# Altium schematic sheet Schematic.schdoc
size 800 x 327 mm
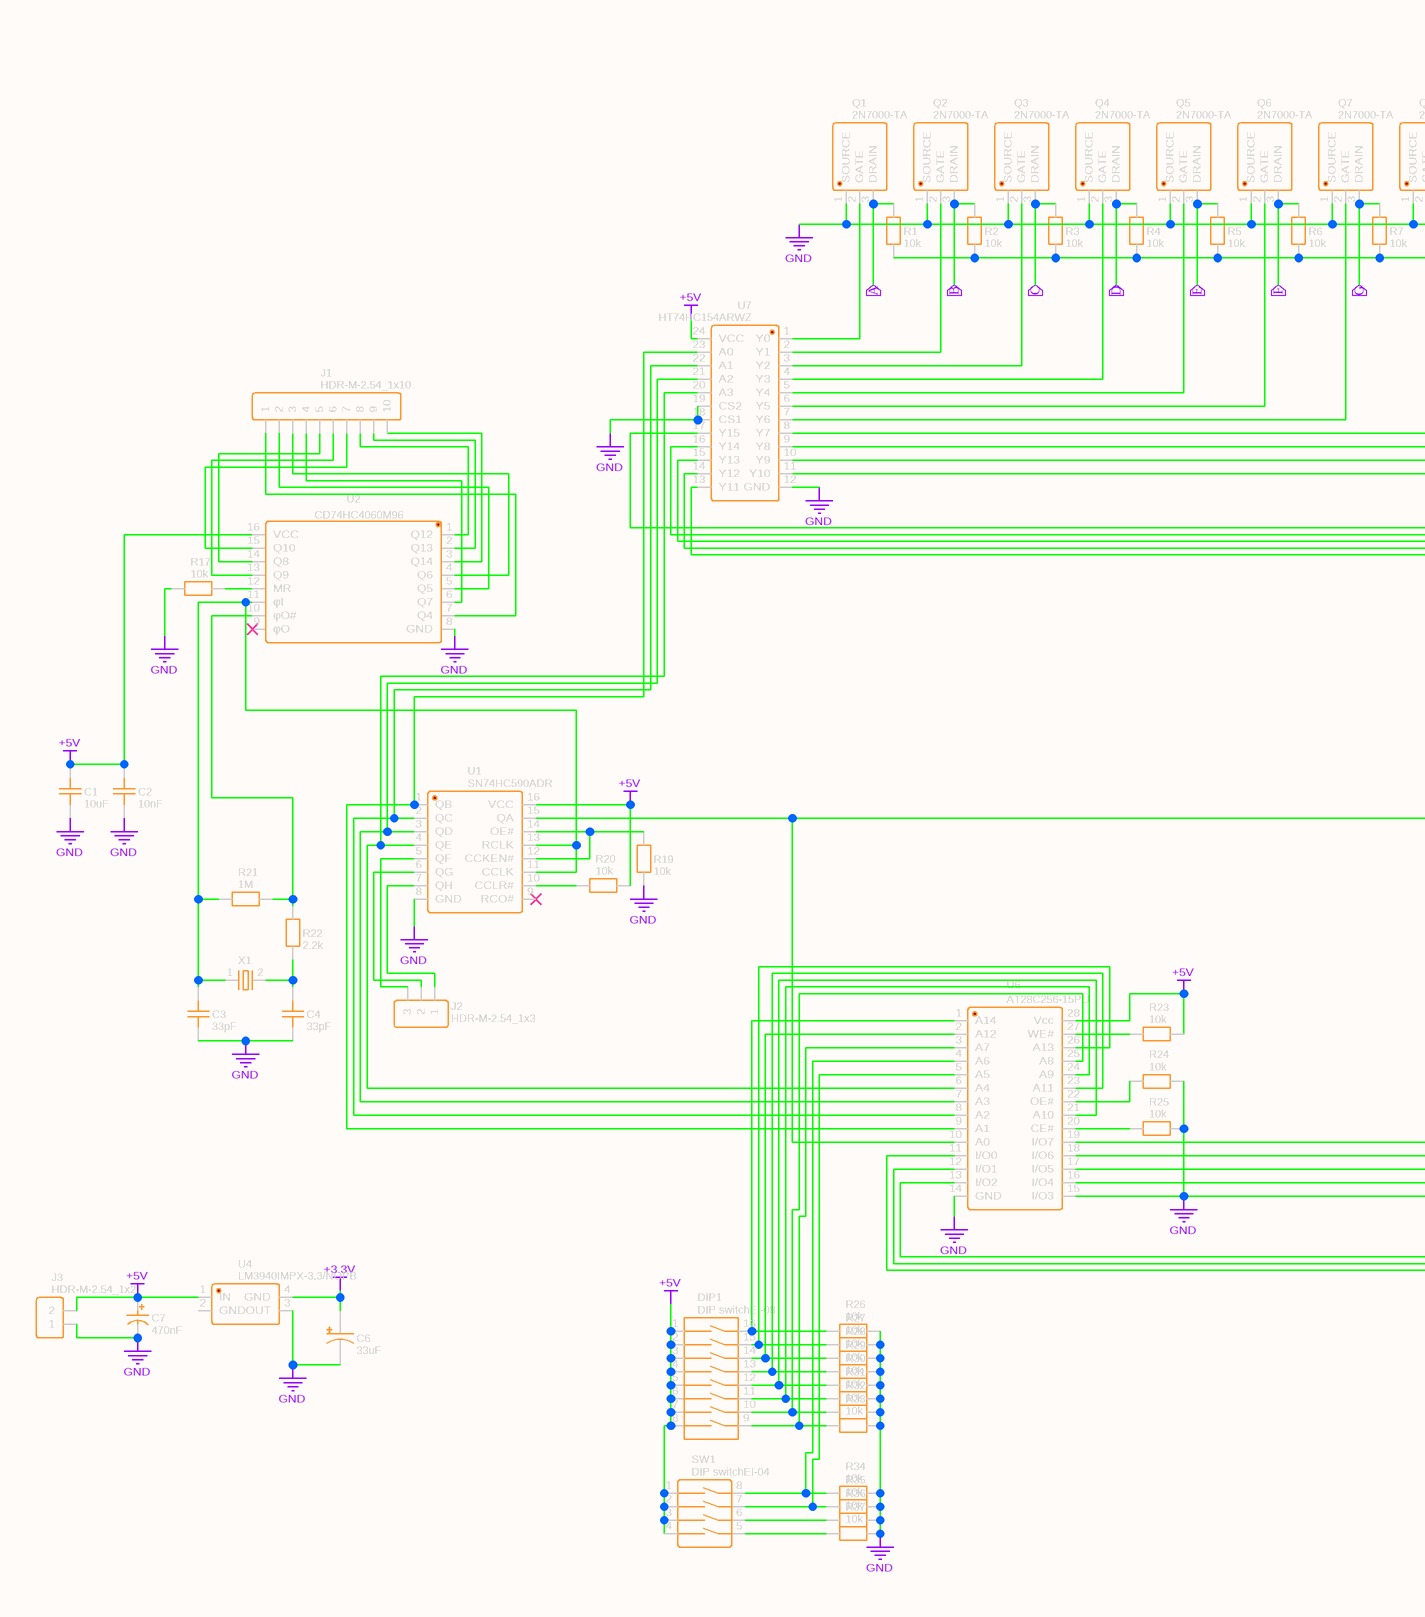
[diagram p0: Schematic.schdoc, left]
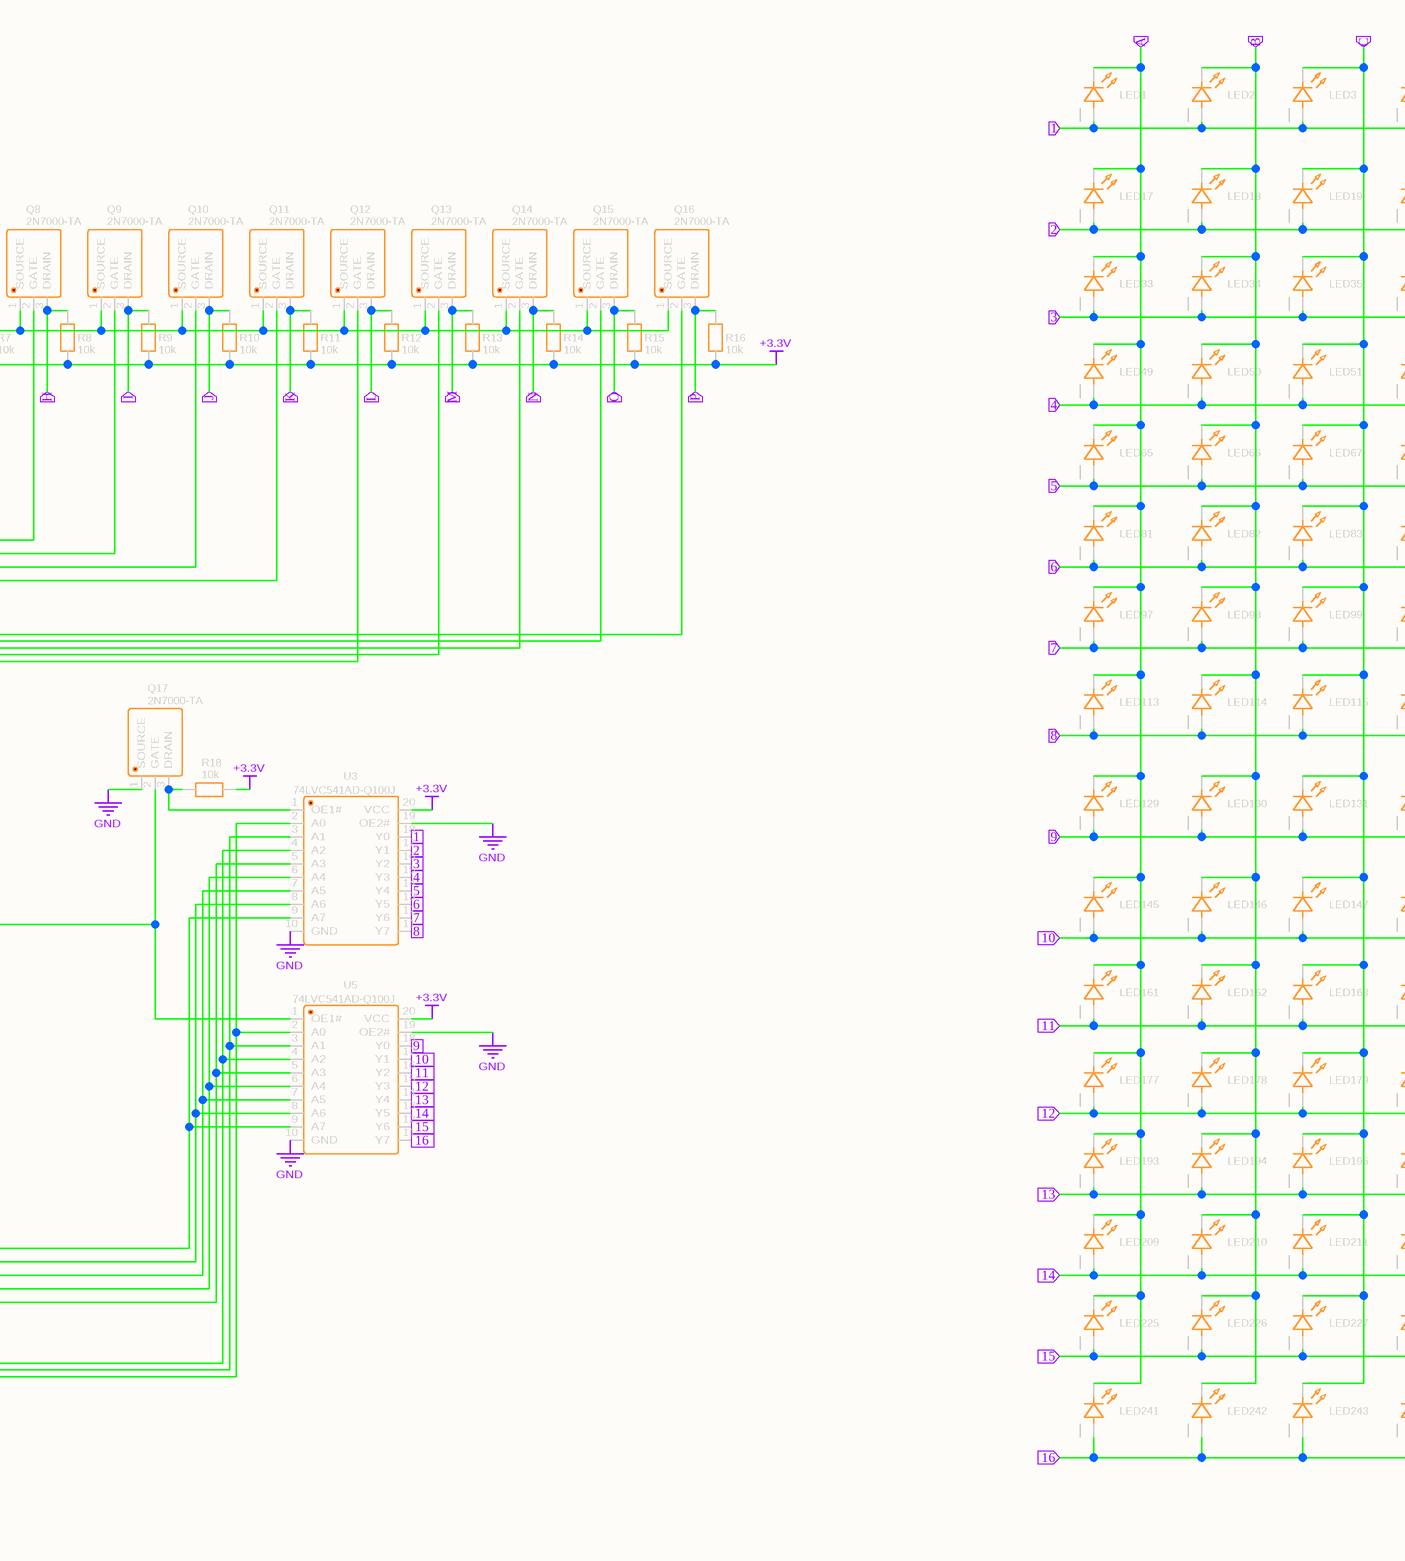
[diagram p1: Schematic.schdoc, middle]
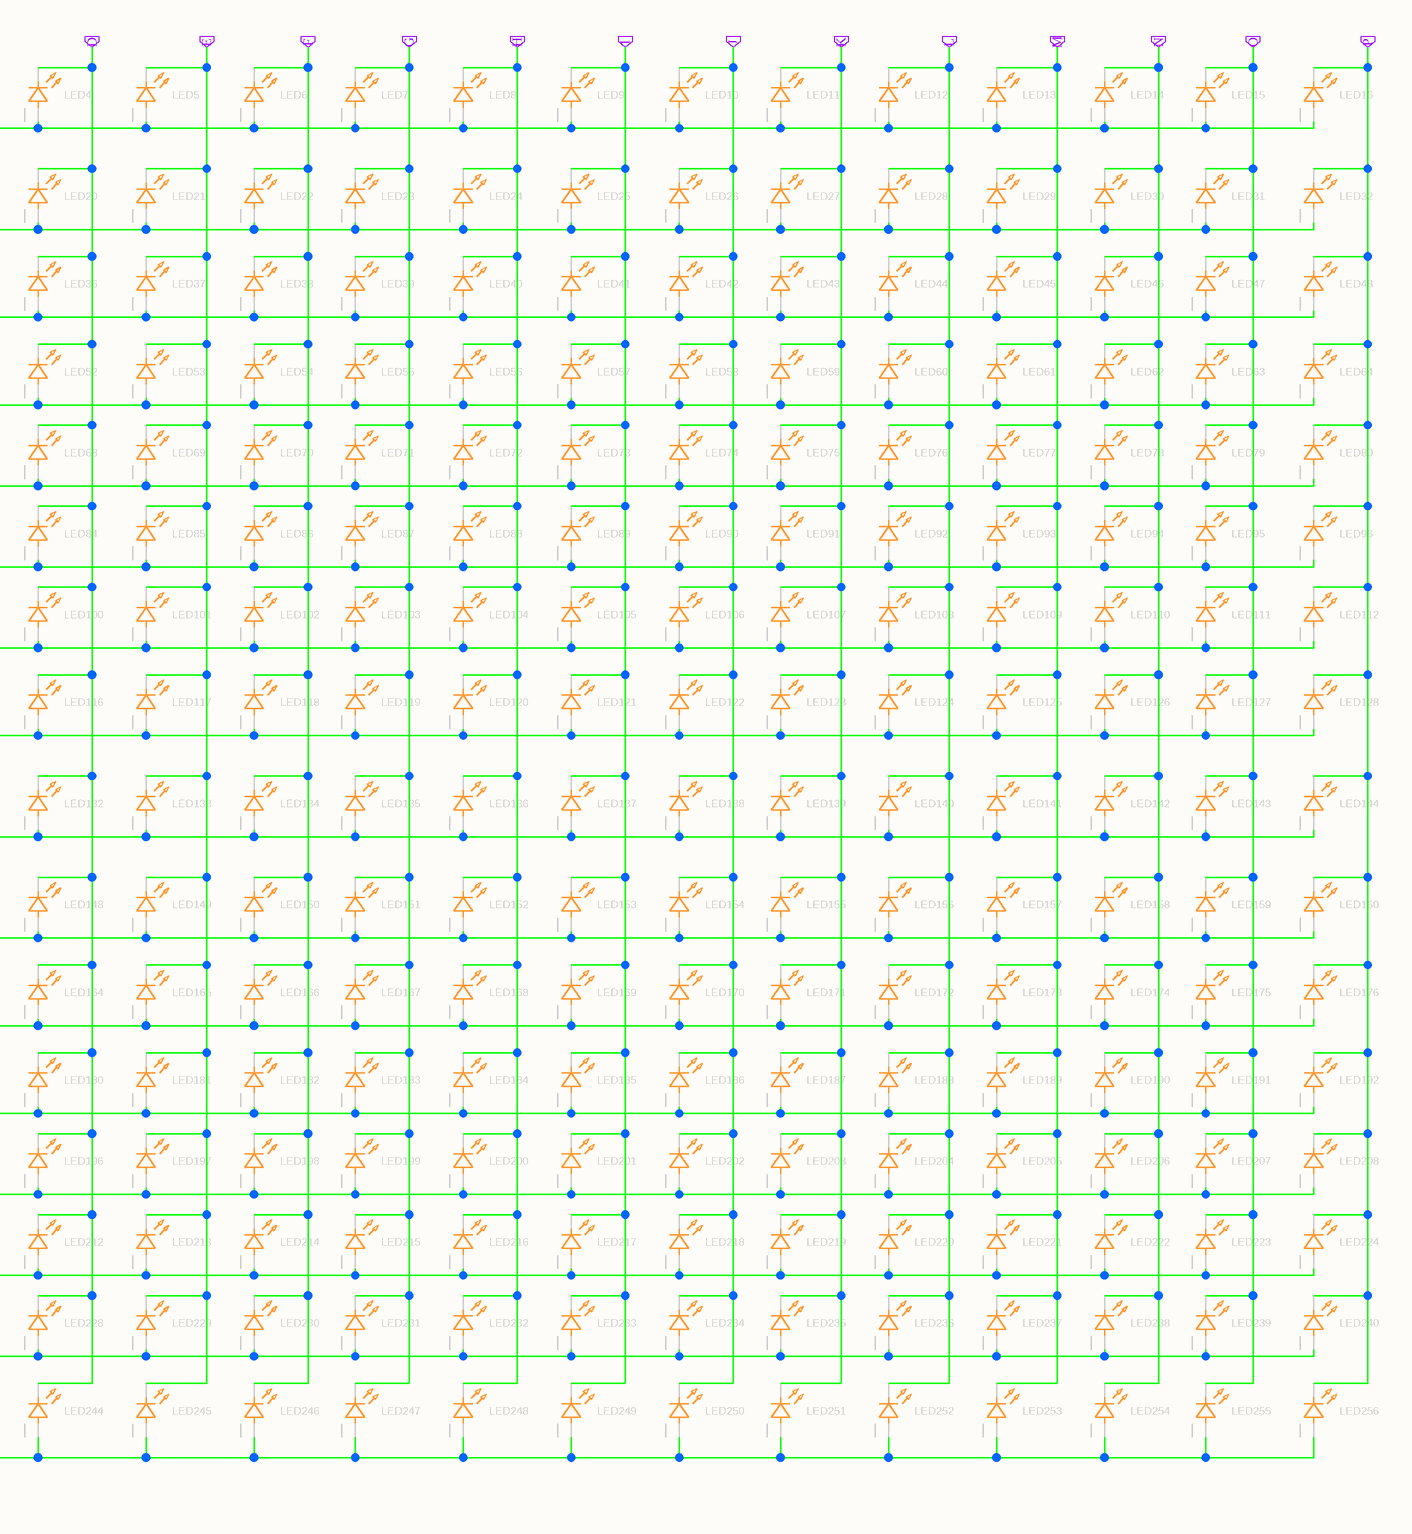
[diagram p2: Schematic.schdoc, right]

## Parts
C1  10uF  [C1210]
C2  10nF  [C0805]
C3  33pF  [C0805]
C4  33pF  [C0805]
C6  33uF  [CAP-TH_BD6.3-P2.50-D0.5-FD]
C7  470nF  [CAP-TH_BD4.0-P1.50-D0.8-FD]
DIP1  DIP switchEI-08  [SW-TH_16P-L20.5-W6.0-P2.54]
J1  HDR-M-2.54_1x10  [HDR-M-2.54_1X10]
J2  HDR-M-2.54_1x3  [HDR-M-2.54_1X3]
J3  HDR-M-2.54_1x2  [HDR-M-2.54_1X2]
LED1  HL-A-5730D34WY-S1-08-CZ(LY)  [LED-SMD_HL-A-5730D34WY-S1-08-CZ]  (value not drawn)
LED2  HL-A-5730D34WY-S1-08-CZ(LY)  [LED-SMD_HL-A-5730D34WY-S1-08-CZ]  (value not drawn)
LED3  HL-A-5730D34WY-S1-08-CZ(LY)  [LED-SMD_HL-A-5730D34WY-S1-08-CZ]  (value not drawn)
LED4  HL-A-5730D34WY-S1-08-CZ(LY)  [LED-SMD_HL-A-5730D34WY-S1-08-CZ]  (value not drawn)
LED5  HL-A-5730D34WY-S1-08-CZ(LY)  [LED-SMD_HL-A-5730D34WY-S1-08-CZ]  (value not drawn)
LED6  HL-A-5730D34WY-S1-08-CZ(LY)  [LED-SMD_HL-A-5730D34WY-S1-08-CZ]  (value not drawn)
LED7  HL-A-5730D34WY-S1-08-CZ(LY)  [LED-SMD_HL-A-5730D34WY-S1-08-CZ]  (value not drawn)
LED8  HL-A-5730D34WY-S1-08-CZ(LY)  [LED-SMD_HL-A-5730D34WY-S1-08-CZ]  (value not drawn)
LED9  HL-A-5730D34WY-S1-08-CZ(LY)  [LED-SMD_HL-A-5730D34WY-S1-08-CZ]  (value not drawn)
LED10  HL-A-5730D34WY-S1-08-CZ(LY)  [LED-SMD_HL-A-5730D34WY-S1-08-CZ]  (value not drawn)
LED11  HL-A-5730D34WY-S1-08-CZ(LY)  [LED-SMD_HL-A-5730D34WY-S1-08-CZ]  (value not drawn)
LED12  HL-A-5730D34WY-S1-08-CZ(LY)  [LED-SMD_HL-A-5730D34WY-S1-08-CZ]  (value not drawn)
LED13  HL-A-5730D34WY-S1-08-CZ(LY)  [LED-SMD_HL-A-5730D34WY-S1-08-CZ]  (value not drawn)
LED14  HL-A-5730D34WY-S1-08-CZ(LY)  [LED-SMD_HL-A-5730D34WY-S1-08-CZ]  (value not drawn)
LED15  HL-A-5730D34WY-S1-08-CZ(LY)  [LED-SMD_HL-A-5730D34WY-S1-08-CZ]  (value not drawn)
LED16  HL-A-5730D34WY-S1-08-CZ(LY)  [LED-SMD_HL-A-5730D34WY-S1-08-CZ]  (value not drawn)
LED17  HL-A-5730D34WY-S1-08-CZ(LY)  [LED-SMD_HL-A-5730D34WY-S1-08-CZ]  (value not drawn)
LED18  HL-A-5730D34WY-S1-08-CZ(LY)  [LED-SMD_HL-A-5730D34WY-S1-08-CZ]  (value not drawn)
LED19  HL-A-5730D34WY-S1-08-CZ(LY)  [LED-SMD_HL-A-5730D34WY-S1-08-CZ]  (value not drawn)
LED20  HL-A-5730D34WY-S1-08-CZ(LY)  [LED-SMD_HL-A-5730D34WY-S1-08-CZ]  (value not drawn)
LED21  HL-A-5730D34WY-S1-08-CZ(LY)  [LED-SMD_HL-A-5730D34WY-S1-08-CZ]  (value not drawn)
LED22  HL-A-5730D34WY-S1-08-CZ(LY)  [LED-SMD_HL-A-5730D34WY-S1-08-CZ]  (value not drawn)
LED23  HL-A-5730D34WY-S1-08-CZ(LY)  [LED-SMD_HL-A-5730D34WY-S1-08-CZ]  (value not drawn)
LED24  HL-A-5730D34WY-S1-08-CZ(LY)  [LED-SMD_HL-A-5730D34WY-S1-08-CZ]  (value not drawn)
LED25  HL-A-5730D34WY-S1-08-CZ(LY)  [LED-SMD_HL-A-5730D34WY-S1-08-CZ]  (value not drawn)
LED26  HL-A-5730D34WY-S1-08-CZ(LY)  [LED-SMD_HL-A-5730D34WY-S1-08-CZ]  (value not drawn)
LED27  HL-A-5730D34WY-S1-08-CZ(LY)  [LED-SMD_HL-A-5730D34WY-S1-08-CZ]  (value not drawn)
LED28  HL-A-5730D34WY-S1-08-CZ(LY)  [LED-SMD_HL-A-5730D34WY-S1-08-CZ]  (value not drawn)
LED29  HL-A-5730D34WY-S1-08-CZ(LY)  [LED-SMD_HL-A-5730D34WY-S1-08-CZ]  (value not drawn)
LED30  HL-A-5730D34WY-S1-08-CZ(LY)  [LED-SMD_HL-A-5730D34WY-S1-08-CZ]  (value not drawn)
LED31  HL-A-5730D34WY-S1-08-CZ(LY)  [LED-SMD_HL-A-5730D34WY-S1-08-CZ]  (value not drawn)
LED32  HL-A-5730D34WY-S1-08-CZ(LY)  [LED-SMD_HL-A-5730D34WY-S1-08-CZ]  (value not drawn)
LED33  HL-A-5730D34WY-S1-08-CZ(LY)  [LED-SMD_HL-A-5730D34WY-S1-08-CZ]  (value not drawn)
LED34  HL-A-5730D34WY-S1-08-CZ(LY)  [LED-SMD_HL-A-5730D34WY-S1-08-CZ]  (value not drawn)
LED35  HL-A-5730D34WY-S1-08-CZ(LY)  [LED-SMD_HL-A-5730D34WY-S1-08-CZ]  (value not drawn)
LED36  HL-A-5730D34WY-S1-08-CZ(LY)  [LED-SMD_HL-A-5730D34WY-S1-08-CZ]  (value not drawn)
LED37  HL-A-5730D34WY-S1-08-CZ(LY)  [LED-SMD_HL-A-5730D34WY-S1-08-CZ]  (value not drawn)
LED38  HL-A-5730D34WY-S1-08-CZ(LY)  [LED-SMD_HL-A-5730D34WY-S1-08-CZ]  (value not drawn)
LED39  HL-A-5730D34WY-S1-08-CZ(LY)  [LED-SMD_HL-A-5730D34WY-S1-08-CZ]  (value not drawn)
LED40  HL-A-5730D34WY-S1-08-CZ(LY)  [LED-SMD_HL-A-5730D34WY-S1-08-CZ]  (value not drawn)
LED41  HL-A-5730D34WY-S1-08-CZ(LY)  [LED-SMD_HL-A-5730D34WY-S1-08-CZ]  (value not drawn)
LED42  HL-A-5730D34WY-S1-08-CZ(LY)  [LED-SMD_HL-A-5730D34WY-S1-08-CZ]  (value not drawn)
LED43  HL-A-5730D34WY-S1-08-CZ(LY)  [LED-SMD_HL-A-5730D34WY-S1-08-CZ]  (value not drawn)
LED44  HL-A-5730D34WY-S1-08-CZ(LY)  [LED-SMD_HL-A-5730D34WY-S1-08-CZ]  (value not drawn)
LED45  HL-A-5730D34WY-S1-08-CZ(LY)  [LED-SMD_HL-A-5730D34WY-S1-08-CZ]  (value not drawn)
LED46  HL-A-5730D34WY-S1-08-CZ(LY)  [LED-SMD_HL-A-5730D34WY-S1-08-CZ]  (value not drawn)
LED47  HL-A-5730D34WY-S1-08-CZ(LY)  [LED-SMD_HL-A-5730D34WY-S1-08-CZ]  (value not drawn)
LED48  HL-A-5730D34WY-S1-08-CZ(LY)  [LED-SMD_HL-A-5730D34WY-S1-08-CZ]  (value not drawn)
LED49  HL-A-5730D34WY-S1-08-CZ(LY)  [LED-SMD_HL-A-5730D34WY-S1-08-CZ]  (value not drawn)
LED50  HL-A-5730D34WY-S1-08-CZ(LY)  [LED-SMD_HL-A-5730D34WY-S1-08-CZ]  (value not drawn)
LED51  HL-A-5730D34WY-S1-08-CZ(LY)  [LED-SMD_HL-A-5730D34WY-S1-08-CZ]  (value not drawn)
LED52  HL-A-5730D34WY-S1-08-CZ(LY)  [LED-SMD_HL-A-5730D34WY-S1-08-CZ]  (value not drawn)
LED53  HL-A-5730D34WY-S1-08-CZ(LY)  [LED-SMD_HL-A-5730D34WY-S1-08-CZ]  (value not drawn)
LED54  HL-A-5730D34WY-S1-08-CZ(LY)  [LED-SMD_HL-A-5730D34WY-S1-08-CZ]  (value not drawn)
LED55  HL-A-5730D34WY-S1-08-CZ(LY)  [LED-SMD_HL-A-5730D34WY-S1-08-CZ]  (value not drawn)
LED56  HL-A-5730D34WY-S1-08-CZ(LY)  [LED-SMD_HL-A-5730D34WY-S1-08-CZ]  (value not drawn)
LED57  HL-A-5730D34WY-S1-08-CZ(LY)  [LED-SMD_HL-A-5730D34WY-S1-08-CZ]  (value not drawn)
LED58  HL-A-5730D34WY-S1-08-CZ(LY)  [LED-SMD_HL-A-5730D34WY-S1-08-CZ]  (value not drawn)
LED59  HL-A-5730D34WY-S1-08-CZ(LY)  [LED-SMD_HL-A-5730D34WY-S1-08-CZ]  (value not drawn)
LED60  HL-A-5730D34WY-S1-08-CZ(LY)  [LED-SMD_HL-A-5730D34WY-S1-08-CZ]  (value not drawn)
LED61  HL-A-5730D34WY-S1-08-CZ(LY)  [LED-SMD_HL-A-5730D34WY-S1-08-CZ]  (value not drawn)
LED62  HL-A-5730D34WY-S1-08-CZ(LY)  [LED-SMD_HL-A-5730D34WY-S1-08-CZ]  (value not drawn)
LED63  HL-A-5730D34WY-S1-08-CZ(LY)  [LED-SMD_HL-A-5730D34WY-S1-08-CZ]  (value not drawn)
LED64  HL-A-5730D34WY-S1-08-CZ(LY)  [LED-SMD_HL-A-5730D34WY-S1-08-CZ]  (value not drawn)
LED65  HL-A-5730D34WY-S1-08-CZ(LY)  [LED-SMD_HL-A-5730D34WY-S1-08-CZ]  (value not drawn)
LED66  HL-A-5730D34WY-S1-08-CZ(LY)  [LED-SMD_HL-A-5730D34WY-S1-08-CZ]  (value not drawn)
LED67  HL-A-5730D34WY-S1-08-CZ(LY)  [LED-SMD_HL-A-5730D34WY-S1-08-CZ]  (value not drawn)
LED68  HL-A-5730D34WY-S1-08-CZ(LY)  [LED-SMD_HL-A-5730D34WY-S1-08-CZ]  (value not drawn)
LED69  HL-A-5730D34WY-S1-08-CZ(LY)  [LED-SMD_HL-A-5730D34WY-S1-08-CZ]  (value not drawn)
LED70  HL-A-5730D34WY-S1-08-CZ(LY)  [LED-SMD_HL-A-5730D34WY-S1-08-CZ]  (value not drawn)
LED71  HL-A-5730D34WY-S1-08-CZ(LY)  [LED-SMD_HL-A-5730D34WY-S1-08-CZ]  (value not drawn)
LED72  HL-A-5730D34WY-S1-08-CZ(LY)  [LED-SMD_HL-A-5730D34WY-S1-08-CZ]  (value not drawn)
LED73  HL-A-5730D34WY-S1-08-CZ(LY)  [LED-SMD_HL-A-5730D34WY-S1-08-CZ]  (value not drawn)
LED74  HL-A-5730D34WY-S1-08-CZ(LY)  [LED-SMD_HL-A-5730D34WY-S1-08-CZ]  (value not drawn)
LED75  HL-A-5730D34WY-S1-08-CZ(LY)  [LED-SMD_HL-A-5730D34WY-S1-08-CZ]  (value not drawn)
LED76  HL-A-5730D34WY-S1-08-CZ(LY)  [LED-SMD_HL-A-5730D34WY-S1-08-CZ]  (value not drawn)
LED77  HL-A-5730D34WY-S1-08-CZ(LY)  [LED-SMD_HL-A-5730D34WY-S1-08-CZ]  (value not drawn)
LED78  HL-A-5730D34WY-S1-08-CZ(LY)  [LED-SMD_HL-A-5730D34WY-S1-08-CZ]  (value not drawn)
LED79  HL-A-5730D34WY-S1-08-CZ(LY)  [LED-SMD_HL-A-5730D34WY-S1-08-CZ]  (value not drawn)
LED80  HL-A-5730D34WY-S1-08-CZ(LY)  [LED-SMD_HL-A-5730D34WY-S1-08-CZ]  (value not drawn)
LED81  HL-A-5730D34WY-S1-08-CZ(LY)  [LED-SMD_HL-A-5730D34WY-S1-08-CZ]  (value not drawn)
LED82  HL-A-5730D34WY-S1-08-CZ(LY)  [LED-SMD_HL-A-5730D34WY-S1-08-CZ]  (value not drawn)
LED83  HL-A-5730D34WY-S1-08-CZ(LY)  [LED-SMD_HL-A-5730D34WY-S1-08-CZ]  (value not drawn)
LED84  HL-A-5730D34WY-S1-08-CZ(LY)  [LED-SMD_HL-A-5730D34WY-S1-08-CZ]  (value not drawn)
LED85  HL-A-5730D34WY-S1-08-CZ(LY)  [LED-SMD_HL-A-5730D34WY-S1-08-CZ]  (value not drawn)
LED86  HL-A-5730D34WY-S1-08-CZ(LY)  [LED-SMD_HL-A-5730D34WY-S1-08-CZ]  (value not drawn)
LED87  HL-A-5730D34WY-S1-08-CZ(LY)  [LED-SMD_HL-A-5730D34WY-S1-08-CZ]  (value not drawn)
LED88  HL-A-5730D34WY-S1-08-CZ(LY)  [LED-SMD_HL-A-5730D34WY-S1-08-CZ]  (value not drawn)
LED89  HL-A-5730D34WY-S1-08-CZ(LY)  [LED-SMD_HL-A-5730D34WY-S1-08-CZ]  (value not drawn)
LED90  HL-A-5730D34WY-S1-08-CZ(LY)  [LED-SMD_HL-A-5730D34WY-S1-08-CZ]  (value not drawn)
LED91  HL-A-5730D34WY-S1-08-CZ(LY)  [LED-SMD_HL-A-5730D34WY-S1-08-CZ]  (value not drawn)
LED92  HL-A-5730D34WY-S1-08-CZ(LY)  [LED-SMD_HL-A-5730D34WY-S1-08-CZ]  (value not drawn)
LED93  HL-A-5730D34WY-S1-08-CZ(LY)  [LED-SMD_HL-A-5730D34WY-S1-08-CZ]  (value not drawn)
LED94  HL-A-5730D34WY-S1-08-CZ(LY)  [LED-SMD_HL-A-5730D34WY-S1-08-CZ]  (value not drawn)
LED95  HL-A-5730D34WY-S1-08-CZ(LY)  [LED-SMD_HL-A-5730D34WY-S1-08-CZ]  (value not drawn)
LED96  HL-A-5730D34WY-S1-08-CZ(LY)  [LED-SMD_HL-A-5730D34WY-S1-08-CZ]  (value not drawn)
LED97  HL-A-5730D34WY-S1-08-CZ(LY)  [LED-SMD_HL-A-5730D34WY-S1-08-CZ]  (value not drawn)
LED98  HL-A-5730D34WY-S1-08-CZ(LY)  [LED-SMD_HL-A-5730D34WY-S1-08-CZ]  (value not drawn)
LED99  HL-A-5730D34WY-S1-08-CZ(LY)  [LED-SMD_HL-A-5730D34WY-S1-08-CZ]  (value not drawn)
LED100  HL-A-5730D34WY-S1-08-CZ(LY)  [LED-SMD_HL-A-5730D34WY-S1-08-CZ]  (value not drawn)
LED101  HL-A-5730D34WY-S1-08-CZ(LY)  [LED-SMD_HL-A-5730D34WY-S1-08-CZ]  (value not drawn)
LED102  HL-A-5730D34WY-S1-08-CZ(LY)  [LED-SMD_HL-A-5730D34WY-S1-08-CZ]  (value not drawn)
LED103  HL-A-5730D34WY-S1-08-CZ(LY)  [LED-SMD_HL-A-5730D34WY-S1-08-CZ]  (value not drawn)
LED104  HL-A-5730D34WY-S1-08-CZ(LY)  [LED-SMD_HL-A-5730D34WY-S1-08-CZ]  (value not drawn)
LED105  HL-A-5730D34WY-S1-08-CZ(LY)  [LED-SMD_HL-A-5730D34WY-S1-08-CZ]  (value not drawn)
LED106  HL-A-5730D34WY-S1-08-CZ(LY)  [LED-SMD_HL-A-5730D34WY-S1-08-CZ]  (value not drawn)
LED107  HL-A-5730D34WY-S1-08-CZ(LY)  [LED-SMD_HL-A-5730D34WY-S1-08-CZ]  (value not drawn)
LED108  HL-A-5730D34WY-S1-08-CZ(LY)  [LED-SMD_HL-A-5730D34WY-S1-08-CZ]  (value not drawn)
LED109  HL-A-5730D34WY-S1-08-CZ(LY)  [LED-SMD_HL-A-5730D34WY-S1-08-CZ]  (value not drawn)
LED110  HL-A-5730D34WY-S1-08-CZ(LY)  [LED-SMD_HL-A-5730D34WY-S1-08-CZ]  (value not drawn)
LED111  HL-A-5730D34WY-S1-08-CZ(LY)  [LED-SMD_HL-A-5730D34WY-S1-08-CZ]  (value not drawn)
LED112  HL-A-5730D34WY-S1-08-CZ(LY)  [LED-SMD_HL-A-5730D34WY-S1-08-CZ]  (value not drawn)
LED113  HL-A-5730D34WY-S1-08-CZ(LY)  [LED-SMD_HL-A-5730D34WY-S1-08-CZ]  (value not drawn)
LED114  HL-A-5730D34WY-S1-08-CZ(LY)  [LED-SMD_HL-A-5730D34WY-S1-08-CZ]  (value not drawn)
LED115  HL-A-5730D34WY-S1-08-CZ(LY)  [LED-SMD_HL-A-5730D34WY-S1-08-CZ]  (value not drawn)
LED116  HL-A-5730D34WY-S1-08-CZ(LY)  [LED-SMD_HL-A-5730D34WY-S1-08-CZ]  (value not drawn)
LED117  HL-A-5730D34WY-S1-08-CZ(LY)  [LED-SMD_HL-A-5730D34WY-S1-08-CZ]  (value not drawn)
LED118  HL-A-5730D34WY-S1-08-CZ(LY)  [LED-SMD_HL-A-5730D34WY-S1-08-CZ]  (value not drawn)
LED119  HL-A-5730D34WY-S1-08-CZ(LY)  [LED-SMD_HL-A-5730D34WY-S1-08-CZ]  (value not drawn)
LED120  HL-A-5730D34WY-S1-08-CZ(LY)  [LED-SMD_HL-A-5730D34WY-S1-08-CZ]  (value not drawn)
LED121  HL-A-5730D34WY-S1-08-CZ(LY)  [LED-SMD_HL-A-5730D34WY-S1-08-CZ]  (value not drawn)
LED122  HL-A-5730D34WY-S1-08-CZ(LY)  [LED-SMD_HL-A-5730D34WY-S1-08-CZ]  (value not drawn)
LED123  HL-A-5730D34WY-S1-08-CZ(LY)  [LED-SMD_HL-A-5730D34WY-S1-08-CZ]  (value not drawn)
LED124  HL-A-5730D34WY-S1-08-CZ(LY)  [LED-SMD_HL-A-5730D34WY-S1-08-CZ]  (value not drawn)
LED125  HL-A-5730D34WY-S1-08-CZ(LY)  [LED-SMD_HL-A-5730D34WY-S1-08-CZ]  (value not drawn)
LED126  HL-A-5730D34WY-S1-08-CZ(LY)  [LED-SMD_HL-A-5730D34WY-S1-08-CZ]  (value not drawn)
LED127  HL-A-5730D34WY-S1-08-CZ(LY)  [LED-SMD_HL-A-5730D34WY-S1-08-CZ]  (value not drawn)
LED128  HL-A-5730D34WY-S1-08-CZ(LY)  [LED-SMD_HL-A-5730D34WY-S1-08-CZ]  (value not drawn)
LED129  HL-A-5730D34WY-S1-08-CZ(LY)  [LED-SMD_HL-A-5730D34WY-S1-08-CZ]  (value not drawn)
LED130  HL-A-5730D34WY-S1-08-CZ(LY)  [LED-SMD_HL-A-5730D34WY-S1-08-CZ]  (value not drawn)
LED131  HL-A-5730D34WY-S1-08-CZ(LY)  [LED-SMD_HL-A-5730D34WY-S1-08-CZ]  (value not drawn)
LED132  HL-A-5730D34WY-S1-08-CZ(LY)  [LED-SMD_HL-A-5730D34WY-S1-08-CZ]  (value not drawn)
LED133  HL-A-5730D34WY-S1-08-CZ(LY)  [LED-SMD_HL-A-5730D34WY-S1-08-CZ]  (value not drawn)
LED134  HL-A-5730D34WY-S1-08-CZ(LY)  [LED-SMD_HL-A-5730D34WY-S1-08-CZ]  (value not drawn)
LED135  HL-A-5730D34WY-S1-08-CZ(LY)  [LED-SMD_HL-A-5730D34WY-S1-08-CZ]  (value not drawn)
LED136  HL-A-5730D34WY-S1-08-CZ(LY)  [LED-SMD_HL-A-5730D34WY-S1-08-CZ]  (value not drawn)
LED137  HL-A-5730D34WY-S1-08-CZ(LY)  [LED-SMD_HL-A-5730D34WY-S1-08-CZ]  (value not drawn)
LED138  HL-A-5730D34WY-S1-08-CZ(LY)  [LED-SMD_HL-A-5730D34WY-S1-08-CZ]  (value not drawn)
LED139  HL-A-5730D34WY-S1-08-CZ(LY)  [LED-SMD_HL-A-5730D34WY-S1-08-CZ]  (value not drawn)
LED140  HL-A-5730D34WY-S1-08-CZ(LY)  [LED-SMD_HL-A-5730D34WY-S1-08-CZ]  (value not drawn)
LED141  HL-A-5730D34WY-S1-08-CZ(LY)  [LED-SMD_HL-A-5730D34WY-S1-08-CZ]  (value not drawn)
LED142  HL-A-5730D34WY-S1-08-CZ(LY)  [LED-SMD_HL-A-5730D34WY-S1-08-CZ]  (value not drawn)
LED143  HL-A-5730D34WY-S1-08-CZ(LY)  [LED-SMD_HL-A-5730D34WY-S1-08-CZ]  (value not drawn)
LED144  HL-A-5730D34WY-S1-08-CZ(LY)  [LED-SMD_HL-A-5730D34WY-S1-08-CZ]  (value not drawn)
LED145  HL-A-5730D34WY-S1-08-CZ(LY)  [LED-SMD_HL-A-5730D34WY-S1-08-CZ]  (value not drawn)
LED146  HL-A-5730D34WY-S1-08-CZ(LY)  [LED-SMD_HL-A-5730D34WY-S1-08-CZ]  (value not drawn)
LED147  HL-A-5730D34WY-S1-08-CZ(LY)  [LED-SMD_HL-A-5730D34WY-S1-08-CZ]  (value not drawn)
LED148  HL-A-5730D34WY-S1-08-CZ(LY)  [LED-SMD_HL-A-5730D34WY-S1-08-CZ]  (value not drawn)
LED149  HL-A-5730D34WY-S1-08-CZ(LY)  [LED-SMD_HL-A-5730D34WY-S1-08-CZ]  (value not drawn)
LED150  HL-A-5730D34WY-S1-08-CZ(LY)  [LED-SMD_HL-A-5730D34WY-S1-08-CZ]  (value not drawn)
LED151  HL-A-5730D34WY-S1-08-CZ(LY)  [LED-SMD_HL-A-5730D34WY-S1-08-CZ]  (value not drawn)
LED152  HL-A-5730D34WY-S1-08-CZ(LY)  [LED-SMD_HL-A-5730D34WY-S1-08-CZ]  (value not drawn)
LED153  HL-A-5730D34WY-S1-08-CZ(LY)  [LED-SMD_HL-A-5730D34WY-S1-08-CZ]  (value not drawn)
LED154  HL-A-5730D34WY-S1-08-CZ(LY)  [LED-SMD_HL-A-5730D34WY-S1-08-CZ]  (value not drawn)
LED155  HL-A-5730D34WY-S1-08-CZ(LY)  [LED-SMD_HL-A-5730D34WY-S1-08-CZ]  (value not drawn)
LED156  HL-A-5730D34WY-S1-08-CZ(LY)  [LED-SMD_HL-A-5730D34WY-S1-08-CZ]  (value not drawn)
LED157  HL-A-5730D34WY-S1-08-CZ(LY)  [LED-SMD_HL-A-5730D34WY-S1-08-CZ]  (value not drawn)
LED158  HL-A-5730D34WY-S1-08-CZ(LY)  [LED-SMD_HL-A-5730D34WY-S1-08-CZ]  (value not drawn)
LED159  HL-A-5730D34WY-S1-08-CZ(LY)  [LED-SMD_HL-A-5730D34WY-S1-08-CZ]  (value not drawn)
LED160  HL-A-5730D34WY-S1-08-CZ(LY)  [LED-SMD_HL-A-5730D34WY-S1-08-CZ]  (value not drawn)
LED161  HL-A-5730D34WY-S1-08-CZ(LY)  [LED-SMD_HL-A-5730D34WY-S1-08-CZ]  (value not drawn)
LED162  HL-A-5730D34WY-S1-08-CZ(LY)  [LED-SMD_HL-A-5730D34WY-S1-08-CZ]  (value not drawn)
LED163  HL-A-5730D34WY-S1-08-CZ(LY)  [LED-SMD_HL-A-5730D34WY-S1-08-CZ]  (value not drawn)
LED164  HL-A-5730D34WY-S1-08-CZ(LY)  [LED-SMD_HL-A-5730D34WY-S1-08-CZ]  (value not drawn)
LED165  HL-A-5730D34WY-S1-08-CZ(LY)  [LED-SMD_HL-A-5730D34WY-S1-08-CZ]  (value not drawn)
LED166  HL-A-5730D34WY-S1-08-CZ(LY)  [LED-SMD_HL-A-5730D34WY-S1-08-CZ]  (value not drawn)
LED167  HL-A-5730D34WY-S1-08-CZ(LY)  [LED-SMD_HL-A-5730D34WY-S1-08-CZ]  (value not drawn)
LED168  HL-A-5730D34WY-S1-08-CZ(LY)  [LED-SMD_HL-A-5730D34WY-S1-08-CZ]  (value not drawn)
LED169  HL-A-5730D34WY-S1-08-CZ(LY)  [LED-SMD_HL-A-5730D34WY-S1-08-CZ]  (value not drawn)
LED170  HL-A-5730D34WY-S1-08-CZ(LY)  [LED-SMD_HL-A-5730D34WY-S1-08-CZ]  (value not drawn)
LED171  HL-A-5730D34WY-S1-08-CZ(LY)  [LED-SMD_HL-A-5730D34WY-S1-08-CZ]  (value not drawn)
LED172  HL-A-5730D34WY-S1-08-CZ(LY)  [LED-SMD_HL-A-5730D34WY-S1-08-CZ]  (value not drawn)
LED173  HL-A-5730D34WY-S1-08-CZ(LY)  [LED-SMD_HL-A-5730D34WY-S1-08-CZ]  (value not drawn)
LED174  HL-A-5730D34WY-S1-08-CZ(LY)  [LED-SMD_HL-A-5730D34WY-S1-08-CZ]  (value not drawn)
LED175  HL-A-5730D34WY-S1-08-CZ(LY)  [LED-SMD_HL-A-5730D34WY-S1-08-CZ]  (value not drawn)
LED176  HL-A-5730D34WY-S1-08-CZ(LY)  [LED-SMD_HL-A-5730D34WY-S1-08-CZ]  (value not drawn)
LED177  HL-A-5730D34WY-S1-08-CZ(LY)  [LED-SMD_HL-A-5730D34WY-S1-08-CZ]  (value not drawn)
LED178  HL-A-5730D34WY-S1-08-CZ(LY)  [LED-SMD_HL-A-5730D34WY-S1-08-CZ]  (value not drawn)
LED179  HL-A-5730D34WY-S1-08-CZ(LY)  [LED-SMD_HL-A-5730D34WY-S1-08-CZ]  (value not drawn)
LED180  HL-A-5730D34WY-S1-08-CZ(LY)  [LED-SMD_HL-A-5730D34WY-S1-08-CZ]  (value not drawn)
LED181  HL-A-5730D34WY-S1-08-CZ(LY)  [LED-SMD_HL-A-5730D34WY-S1-08-CZ]  (value not drawn)
LED182  HL-A-5730D34WY-S1-08-CZ(LY)  [LED-SMD_HL-A-5730D34WY-S1-08-CZ]  (value not drawn)
LED183  HL-A-5730D34WY-S1-08-CZ(LY)  [LED-SMD_HL-A-5730D34WY-S1-08-CZ]  (value not drawn)
LED184  HL-A-5730D34WY-S1-08-CZ(LY)  [LED-SMD_HL-A-5730D34WY-S1-08-CZ]  (value not drawn)
LED185  HL-A-5730D34WY-S1-08-CZ(LY)  [LED-SMD_HL-A-5730D34WY-S1-08-CZ]  (value not drawn)
LED186  HL-A-5730D34WY-S1-08-CZ(LY)  [LED-SMD_HL-A-5730D34WY-S1-08-CZ]  (value not drawn)
LED187  HL-A-5730D34WY-S1-08-CZ(LY)  [LED-SMD_HL-A-5730D34WY-S1-08-CZ]  (value not drawn)
LED188  HL-A-5730D34WY-S1-08-CZ(LY)  [LED-SMD_HL-A-5730D34WY-S1-08-CZ]  (value not drawn)
LED189  HL-A-5730D34WY-S1-08-CZ(LY)  [LED-SMD_HL-A-5730D34WY-S1-08-CZ]  (value not drawn)
LED190  HL-A-5730D34WY-S1-08-CZ(LY)  [LED-SMD_HL-A-5730D34WY-S1-08-CZ]  (value not drawn)
LED191  HL-A-5730D34WY-S1-08-CZ(LY)  [LED-SMD_HL-A-5730D34WY-S1-08-CZ]  (value not drawn)
LED192  HL-A-5730D34WY-S1-08-CZ(LY)  [LED-SMD_HL-A-5730D34WY-S1-08-CZ]  (value not drawn)
LED193  HL-A-5730D34WY-S1-08-CZ(LY)  [LED-SMD_HL-A-5730D34WY-S1-08-CZ]  (value not drawn)
LED194  HL-A-5730D34WY-S1-08-CZ(LY)  [LED-SMD_HL-A-5730D34WY-S1-08-CZ]  (value not drawn)
LED195  HL-A-5730D34WY-S1-08-CZ(LY)  [LED-SMD_HL-A-5730D34WY-S1-08-CZ]  (value not drawn)
LED196  HL-A-5730D34WY-S1-08-CZ(LY)  [LED-SMD_HL-A-5730D34WY-S1-08-CZ]  (value not drawn)
LED197  HL-A-5730D34WY-S1-08-CZ(LY)  [LED-SMD_HL-A-5730D34WY-S1-08-CZ]  (value not drawn)
LED198  HL-A-5730D34WY-S1-08-CZ(LY)  [LED-SMD_HL-A-5730D34WY-S1-08-CZ]  (value not drawn)
LED199  HL-A-5730D34WY-S1-08-CZ(LY)  [LED-SMD_HL-A-5730D34WY-S1-08-CZ]  (value not drawn)
LED200  HL-A-5730D34WY-S1-08-CZ(LY)  [LED-SMD_HL-A-5730D34WY-S1-08-CZ]  (value not drawn)
LED201  HL-A-5730D34WY-S1-08-CZ(LY)  [LED-SMD_HL-A-5730D34WY-S1-08-CZ]  (value not drawn)
LED202  HL-A-5730D34WY-S1-08-CZ(LY)  [LED-SMD_HL-A-5730D34WY-S1-08-CZ]  (value not drawn)
LED203  HL-A-5730D34WY-S1-08-CZ(LY)  [LED-SMD_HL-A-5730D34WY-S1-08-CZ]  (value not drawn)
LED204  HL-A-5730D34WY-S1-08-CZ(LY)  [LED-SMD_HL-A-5730D34WY-S1-08-CZ]  (value not drawn)
LED205  HL-A-5730D34WY-S1-08-CZ(LY)  [LED-SMD_HL-A-5730D34WY-S1-08-CZ]  (value not drawn)
LED206  HL-A-5730D34WY-S1-08-CZ(LY)  [LED-SMD_HL-A-5730D34WY-S1-08-CZ]  (value not drawn)
LED207  HL-A-5730D34WY-S1-08-CZ(LY)  [LED-SMD_HL-A-5730D34WY-S1-08-CZ]  (value not drawn)
LED208  HL-A-5730D34WY-S1-08-CZ(LY)  [LED-SMD_HL-A-5730D34WY-S1-08-CZ]  (value not drawn)
LED209  HL-A-5730D34WY-S1-08-CZ(LY)  [LED-SMD_HL-A-5730D34WY-S1-08-CZ]  (value not drawn)
LED210  HL-A-5730D34WY-S1-08-CZ(LY)  [LED-SMD_HL-A-5730D34WY-S1-08-CZ]  (value not drawn)
LED211  HL-A-5730D34WY-S1-08-CZ(LY)  [LED-SMD_HL-A-5730D34WY-S1-08-CZ]  (value not drawn)
LED212  HL-A-5730D34WY-S1-08-CZ(LY)  [LED-SMD_HL-A-5730D34WY-S1-08-CZ]  (value not drawn)
LED213  HL-A-5730D34WY-S1-08-CZ(LY)  [LED-SMD_HL-A-5730D34WY-S1-08-CZ]  (value not drawn)
LED214  HL-A-5730D34WY-S1-08-CZ(LY)  [LED-SMD_HL-A-5730D34WY-S1-08-CZ]  (value not drawn)
LED215  HL-A-5730D34WY-S1-08-CZ(LY)  [LED-SMD_HL-A-5730D34WY-S1-08-CZ]  (value not drawn)
LED216  HL-A-5730D34WY-S1-08-CZ(LY)  [LED-SMD_HL-A-5730D34WY-S1-08-CZ]  (value not drawn)
LED217  HL-A-5730D34WY-S1-08-CZ(LY)  [LED-SMD_HL-A-5730D34WY-S1-08-CZ]  (value not drawn)
LED218  HL-A-5730D34WY-S1-08-CZ(LY)  [LED-SMD_HL-A-5730D34WY-S1-08-CZ]  (value not drawn)
LED219  HL-A-5730D34WY-S1-08-CZ(LY)  [LED-SMD_HL-A-5730D34WY-S1-08-CZ]  (value not drawn)
LED220  HL-A-5730D34WY-S1-08-CZ(LY)  [LED-SMD_HL-A-5730D34WY-S1-08-CZ]  (value not drawn)
LED221  HL-A-5730D34WY-S1-08-CZ(LY)  [LED-SMD_HL-A-5730D34WY-S1-08-CZ]  (value not drawn)
LED222  HL-A-5730D34WY-S1-08-CZ(LY)  [LED-SMD_HL-A-5730D34WY-S1-08-CZ]  (value not drawn)
LED223  HL-A-5730D34WY-S1-08-CZ(LY)  [LED-SMD_HL-A-5730D34WY-S1-08-CZ]  (value not drawn)
LED224  HL-A-5730D34WY-S1-08-CZ(LY)  [LED-SMD_HL-A-5730D34WY-S1-08-CZ]  (value not drawn)
LED225  HL-A-5730D34WY-S1-08-CZ(LY)  [LED-SMD_HL-A-5730D34WY-S1-08-CZ]  (value not drawn)
LED226  HL-A-5730D34WY-S1-08-CZ(LY)  [LED-SMD_HL-A-5730D34WY-S1-08-CZ]  (value not drawn)
LED227  HL-A-5730D34WY-S1-08-CZ(LY)  [LED-SMD_HL-A-5730D34WY-S1-08-CZ]  (value not drawn)
LED228  HL-A-5730D34WY-S1-08-CZ(LY)  [LED-SMD_HL-A-5730D34WY-S1-08-CZ]  (value not drawn)
LED229  HL-A-5730D34WY-S1-08-CZ(LY)  [LED-SMD_HL-A-5730D34WY-S1-08-CZ]  (value not drawn)
LED230  HL-A-5730D34WY-S1-08-CZ(LY)  [LED-SMD_HL-A-5730D34WY-S1-08-CZ]  (value not drawn)
LED231  HL-A-5730D34WY-S1-08-CZ(LY)  [LED-SMD_HL-A-5730D34WY-S1-08-CZ]  (value not drawn)
LED232  HL-A-5730D34WY-S1-08-CZ(LY)  [LED-SMD_HL-A-5730D34WY-S1-08-CZ]  (value not drawn)
LED233  HL-A-5730D34WY-S1-08-CZ(LY)  [LED-SMD_HL-A-5730D34WY-S1-08-CZ]  (value not drawn)
LED234  HL-A-5730D34WY-S1-08-CZ(LY)  [LED-SMD_HL-A-5730D34WY-S1-08-CZ]  (value not drawn)
LED235  HL-A-5730D34WY-S1-08-CZ(LY)  [LED-SMD_HL-A-5730D34WY-S1-08-CZ]  (value not drawn)
LED236  HL-A-5730D34WY-S1-08-CZ(LY)  [LED-SMD_HL-A-5730D34WY-S1-08-CZ]  (value not drawn)
LED237  HL-A-5730D34WY-S1-08-CZ(LY)  [LED-SMD_HL-A-5730D34WY-S1-08-CZ]  (value not drawn)
LED238  HL-A-5730D34WY-S1-08-CZ(LY)  [LED-SMD_HL-A-5730D34WY-S1-08-CZ]  (value not drawn)
LED239  HL-A-5730D34WY-S1-08-CZ(LY)  [LED-SMD_HL-A-5730D34WY-S1-08-CZ]  (value not drawn)
LED240  HL-A-5730D34WY-S1-08-CZ(LY)  [LED-SMD_HL-A-5730D34WY-S1-08-CZ]  (value not drawn)
LED241  HL-A-5730D34WY-S1-08-CZ(LY)  [LED-SMD_HL-A-5730D34WY-S1-08-CZ]  (value not drawn)
LED242  HL-A-5730D34WY-S1-08-CZ(LY)  [LED-SMD_HL-A-5730D34WY-S1-08-CZ]  (value not drawn)
LED243  HL-A-5730D34WY-S1-08-CZ(LY)  [LED-SMD_HL-A-5730D34WY-S1-08-CZ]  (value not drawn)
LED244  HL-A-5730D34WY-S1-08-CZ(LY)  [LED-SMD_HL-A-5730D34WY-S1-08-CZ]  (value not drawn)
LED245  HL-A-5730D34WY-S1-08-CZ(LY)  [LED-SMD_HL-A-5730D34WY-S1-08-CZ]  (value not drawn)
LED246  HL-A-5730D34WY-S1-08-CZ(LY)  [LED-SMD_HL-A-5730D34WY-S1-08-CZ]  (value not drawn)
LED247  HL-A-5730D34WY-S1-08-CZ(LY)  [LED-SMD_HL-A-5730D34WY-S1-08-CZ]  (value not drawn)
LED248  HL-A-5730D34WY-S1-08-CZ(LY)  [LED-SMD_HL-A-5730D34WY-S1-08-CZ]  (value not drawn)
LED249  HL-A-5730D34WY-S1-08-CZ(LY)  [LED-SMD_HL-A-5730D34WY-S1-08-CZ]  (value not drawn)
LED250  HL-A-5730D34WY-S1-08-CZ(LY)  [LED-SMD_HL-A-5730D34WY-S1-08-CZ]  (value not drawn)
LED251  HL-A-5730D34WY-S1-08-CZ(LY)  [LED-SMD_HL-A-5730D34WY-S1-08-CZ]  (value not drawn)
LED252  HL-A-5730D34WY-S1-08-CZ(LY)  [LED-SMD_HL-A-5730D34WY-S1-08-CZ]  (value not drawn)
LED253  HL-A-5730D34WY-S1-08-CZ(LY)  [LED-SMD_HL-A-5730D34WY-S1-08-CZ]  (value not drawn)
LED254  HL-A-5730D34WY-S1-08-CZ(LY)  [LED-SMD_HL-A-5730D34WY-S1-08-CZ]  (value not drawn)
LED255  HL-A-5730D34WY-S1-08-CZ(LY)  [LED-SMD_HL-A-5730D34WY-S1-08-CZ]  (value not drawn)
LED256  HL-A-5730D34WY-S1-08-CZ(LY)  [LED-SMD_HL-A-5730D34WY-S1-08-CZ]  (value not drawn)
Q1  2N7000-TA  [TO-92-3_L4.5-W3.5-P1.27-L]
Q2  2N7000-TA  [TO-92-3_L4.5-W3.5-P1.27-L]
Q3  2N7000-TA  [TO-92-3_L4.5-W3.5-P1.27-L]
Q4  2N7000-TA  [TO-92-3_L4.5-W3.5-P1.27-L]
Q5  2N7000-TA  [TO-92-3_L4.5-W3.5-P1.27-L]
Q6  2N7000-TA  [TO-92-3_L4.5-W3.5-P1.27-L]
Q7  2N7000-TA  [TO-92-3_L4.5-W3.5-P1.27-L]
Q8  2N7000-TA  [TO-92-3_L4.5-W3.5-P1.27-L]
Q9  2N7000-TA  [TO-92-3_L4.5-W3.5-P1.27-L]
Q10  2N7000-TA  [TO-92-3_L4.5-W3.5-P1.27-L]
Q11  2N7000-TA  [TO-92-3_L4.5-W3.5-P1.27-L]
Q12  2N7000-TA  [TO-92-3_L4.5-W3.5-P1.27-L]
Q13  2N7000-TA  [TO-92-3_L4.5-W3.5-P1.27-L]
Q14  2N7000-TA  [TO-92-3_L4.5-W3.5-P1.27-L]
Q15  2N7000-TA  [TO-92-3_L4.5-W3.5-P1.27-L]
Q16  2N7000-TA  [TO-92-3_L4.5-W3.5-P1.27-L]
Q17  2N7000-TA  [TO-92-3_L4.5-W3.5-P1.27-L]
R1  10k  [R0603]
R2  10k  [R0603]
R3  10k  [R0603]
R4  10k  [R0603]
R5  10k  [R0603]
R6  10k  [R0603]
R7  10k  [R0603]
R8  10k  [R0603]
R9  10k  [R0603]
R10  10k  [R0603]
R11  10k  [R0603]
R12  10k  [R0603]
R13  10k  [R0603]
R14  10k  [R0603]
R15  10k  [R0603]
R16  10k  [R0603]
R17  10k  [R0603]
R18  10k  [R0603]
R19  10k  [R0603]
R20  10k  [R0603]
R21  1M  [R0603]
R22  2.2k  [R0603]
R23  10k  [R0603]
R24  10k  [R0603]
R25  10k  [R0603]
R26  10k  [R0603]
R27  10k  [R0603]
R28  10k  [R0603]
R29  10k  [R0603]
R30  10k  [R0603]
R31  10k  [R0603]
R32  10k  [R0603]
R33  10k  [R0603]
R34  10k  [R0603]
R35  10k  [R0603]
R36  10k  [R0603]
R37  10k  [R0603]
SW1  DIP switchEI-04  [SW-TH_DIPSWITCHEI-04]
U1  SN74HC590ADR  [SOIC-16_L9.9-W3.9-P1.27-LS6.0-BL]
U2  CD74HC4060M96  [SOIC-16_L10.8-W4.5-P1.27-LS6.8-BL]
U3  74LVC541AD-Q100J  [SO-20_L12.8-W7.5-P1.27-LS10.3-BL]
U4  LM3940IMPX-3.3/NOPB  [SOT-223-4_L6.5-W3.5-P2.30-LS7.0-BR]
U5  74LVC541AD-Q100J  [SO-20_L12.8-W7.5-P1.27-LS10.3-BL]
U6  AT28C256-15PU  [PDIP-28_L37.0-W13.5-P2.54-LS15.6-BL]
U7  HT74HC154ARWZ  [SOIC-24_L15.4-W7.5-P1.27-LS10.3-BL]
X1  32.768kHz  [CRYSTAL-SMD_L3.2-W1.5-FC-135R32.7680KF-A3]  (value not drawn)

## Ports
1 (in), 2 (in), 3 (in), 4 (in), 5 (in), 6 (in), 7 (in), 8 (in), 9 (in), 10 (in), 11 (in), 12 (in), 13 (in), 14 (in), 15 (in), 16 (in), A (in), B (in), C (in), D (in), E (in), F (in), G (in), H (in), I (in), J (in), K (in), L (in), M (in), N (in), O (in), P (in)

## Nets
+3.3V: C6.1 R1.1 R2.1 R3.1 R4.1 R5.1 R6.1 R7.1 R8.1 R9.1 R10.1 R11.1 R12.1 R13.1 R14.1 R15.1 R16.1 R18.2 U3.20(VCC) U4.4(GND) U5.20(VCC)
+5V: C1.2 C2.2 C7.1 DIP1.1 DIP1.2 DIP1.3 DIP1.4 DIP1.5 DIP1.6 DIP1.7 DIP1.8 J3.2 R20.2 R23.2 SW1.1 SW1.2 SW1.3 SW1.4 U1.16(VCC) U2.16(VCC) U4.1(IN) U6.28(Vcc) U7.24(VCC)
GND: C1.1 C2.1 C3.1 C4.1 C6.2 C7.2 J3.1 Q1.1(SOURCE) Q2.1(SOURCE) Q3.1(SOURCE) Q4.1(SOURCE) Q5.1(SOURCE) Q6.1(SOURCE) Q7.1(SOURCE) Q8.1(SOURCE) Q9.1(SOURCE) Q10.1(SOURCE) Q11.1(SOURCE) Q12.1(SOURCE) Q13.1(SOURCE) Q14.1(SOURCE) Q15.1(SOURCE) Q16.1(SOURCE) Q17.1(SOURCE) R17.1 R19.1 R24.2 R25.2 R26.2 R27.2 R28.2 R29.2 R30.2 R31.2 R32.2 R33.2 R34.2 R35.2 R36.2 R37.2 U1.8(GND) U2.8(GND) U3.5(A3) U3.10(GND) U3.19(OE2#) U4.3(OUT) U5.5(A3) U5.10(GND) U5.19(OE2#) U6.14(GND) U6.15(I/O3) U7.12(GND) U7.18(CS1) U7.19(CS2)
1: LED1.2(A) LED2.2(A) LED3.2(A) LED4.2(A) LED5.2(A) LED6.2(A) LED7.2(A) LED8.2(A) LED9.2(A) LED10.2(A) LED11.2(A) LED12.2(A) LED13.2(A) LED14.2(A) LED15.2(A) LED16.2(A) U3.18(Y0) ; port 1
2: LED17.2(A) LED18.2(A) LED19.2(A) LED20.2(A) LED21.2(A) LED22.2(A) LED23.2(A) LED24.2(A) LED25.2(A) LED26.2(A) LED27.2(A) LED28.2(A) LED29.2(A) LED30.2(A) LED31.2(A) LED32.2(A) U3.17(Y1) ; port 2
3: LED33.2(A) LED34.2(A) LED35.2(A) LED36.2(A) LED37.2(A) LED38.2(A) LED39.2(A) LED40.2(A) LED41.2(A) LED42.2(A) LED43.2(A) LED44.2(A) LED45.2(A) LED46.2(A) LED47.2(A) LED48.2(A) U3.16(Y2) ; port 3
4: LED49.2(A) LED50.2(A) LED51.2(A) LED52.2(A) LED53.2(A) LED54.2(A) LED55.2(A) LED56.2(A) LED57.2(A) LED58.2(A) LED59.2(A) LED60.2(A) LED61.2(A) LED62.2(A) LED63.2(A) LED64.2(A) U3.15(Y3) ; port 4
5: LED65.2(A) LED66.2(A) LED67.2(A) LED68.2(A) LED69.2(A) LED70.2(A) LED71.2(A) LED72.2(A) LED73.2(A) LED74.2(A) LED75.2(A) LED76.2(A) LED77.2(A) LED78.2(A) LED79.2(A) LED80.2(A) U3.14(Y4) ; port 5
6: LED81.2(A) LED82.2(A) LED83.2(A) LED84.2(A) LED85.2(A) LED86.2(A) LED87.2(A) LED88.2(A) LED89.2(A) LED90.2(A) LED91.2(A) LED92.2(A) LED93.2(A) LED94.2(A) LED95.2(A) LED96.2(A) U3.13(Y5) ; port 6
7: LED97.2(A) LED98.2(A) LED99.2(A) LED100.2(A) LED101.2(A) LED102.2(A) LED103.2(A) LED104.2(A) LED105.2(A) LED106.2(A) LED107.2(A) LED108.2(A) LED109.2(A) LED110.2(A) LED111.2(A) LED112.2(A) U3.12(Y6) ; port 7
8: LED113.2(A) LED114.2(A) LED115.2(A) LED116.2(A) LED117.2(A) LED118.2(A) LED119.2(A) LED120.2(A) LED121.2(A) LED122.2(A) LED123.2(A) LED124.2(A) LED125.2(A) LED126.2(A) LED127.2(A) LED128.2(A) U3.11(Y7) ; port 8
9: LED129.2(A) LED130.2(A) LED131.2(A) LED132.2(A) LED133.2(A) LED134.2(A) LED135.2(A) LED136.2(A) LED137.2(A) LED138.2(A) LED139.2(A) LED140.2(A) LED141.2(A) LED142.2(A) LED143.2(A) LED144.2(A) U5.18(Y0) ; port 9
10: LED145.2(A) LED146.2(A) LED147.2(A) LED148.2(A) LED149.2(A) LED150.2(A) LED151.2(A) LED152.2(A) LED153.2(A) LED154.2(A) LED155.2(A) LED156.2(A) LED157.2(A) LED158.2(A) LED159.2(A) LED160.2(A) U5.17(Y1) ; port 10
11: LED161.2(A) LED162.2(A) LED163.2(A) LED164.2(A) LED165.2(A) LED166.2(A) LED167.2(A) LED168.2(A) LED169.2(A) LED170.2(A) LED171.2(A) LED172.2(A) LED173.2(A) LED174.2(A) LED175.2(A) LED176.2(A) U5.16(Y2) ; port 11
12: LED177.2(A) LED178.2(A) LED179.2(A) LED180.2(A) LED181.2(A) LED182.2(A) LED183.2(A) LED184.2(A) LED185.2(A) LED186.2(A) LED187.2(A) LED188.2(A) LED189.2(A) LED190.2(A) LED191.2(A) LED192.2(A) U5.15(Y3) ; port 12
13: LED193.2(A) LED194.2(A) LED195.2(A) LED196.2(A) LED197.2(A) LED198.2(A) LED199.2(A) LED200.2(A) LED201.2(A) LED202.2(A) LED203.2(A) LED204.2(A) LED205.2(A) LED206.2(A) LED207.2(A) LED208.2(A) U5.14(Y4) ; port 13
14: LED209.2(A) LED210.2(A) LED211.2(A) LED212.2(A) LED213.2(A) LED214.2(A) LED215.2(A) LED216.2(A) LED217.2(A) LED218.2(A) LED219.2(A) LED220.2(A) LED221.2(A) LED222.2(A) LED223.2(A) LED224.2(A) U5.13(Y5) ; port 14
15: LED225.2(A) LED226.2(A) LED227.2(A) LED228.2(A) LED229.2(A) LED230.2(A) LED231.2(A) LED232.2(A) LED233.2(A) LED234.2(A) LED235.2(A) LED236.2(A) LED237.2(A) LED238.2(A) LED239.2(A) LED240.2(A) U5.12(Y6) ; port 15
16: LED241.2(A) LED242.2(A) LED243.2(A) LED244.2(A) LED245.2(A) LED246.2(A) LED247.2(A) LED248.2(A) LED249.2(A) LED250.2(A) LED251.2(A) LED252.2(A) LED253.2(A) LED254.2(A) LED255.2(A) LED256.2(A) U5.11(Y7) ; port 16
A: LED1.1(C) LED17.1(C) LED33.1(C) LED49.1(C) LED65.1(C) LED81.1(C) LED97.1(C) LED113.1(C) LED129.1(C) LED145.1(C) LED161.1(C) LED177.1(C) LED193.1(C) LED209.1(C) LED225.1(C) LED241.1(C) Q1.3(DRAIN) R1.2 ; port A
B: LED2.1(C) LED18.1(C) LED34.1(C) LED50.1(C) LED66.1(C) LED82.1(C) LED98.1(C) LED114.1(C) LED130.1(C) LED146.1(C) LED162.1(C) LED178.1(C) LED194.1(C) LED210.1(C) LED226.1(C) LED242.1(C) Q2.3(DRAIN) R2.2 ; port B
C: LED3.1(C) LED19.1(C) LED35.1(C) LED51.1(C) LED67.1(C) LED83.1(C) LED99.1(C) LED115.1(C) LED131.1(C) LED147.1(C) LED163.1(C) LED179.1(C) LED195.1(C) LED211.1(C) LED227.1(C) LED243.1(C) Q3.3(DRAIN) R3.2 ; port C
D: LED4.1(C) LED20.1(C) LED36.1(C) LED52.1(C) LED68.1(C) LED84.1(C) LED100.1(C) LED116.1(C) LED132.1(C) LED148.1(C) LED164.1(C) LED180.1(C) LED196.1(C) LED212.1(C) LED228.1(C) LED244.1(C) Q4.3(DRAIN) R4.2 ; port D
E: LED5.1(C) LED21.1(C) LED37.1(C) LED53.1(C) LED69.1(C) LED85.1(C) LED101.1(C) LED117.1(C) LED133.1(C) LED149.1(C) LED165.1(C) LED181.1(C) LED197.1(C) LED213.1(C) LED229.1(C) LED245.1(C) Q5.3(DRAIN) R5.2 ; port E
F: LED6.1(C) LED22.1(C) LED38.1(C) LED54.1(C) LED70.1(C) LED86.1(C) LED102.1(C) LED118.1(C) LED134.1(C) LED150.1(C) LED166.1(C) LED182.1(C) LED198.1(C) LED214.1(C) LED230.1(C) LED246.1(C) Q6.3(DRAIN) R6.2 ; port F
G: LED7.1(C) LED23.1(C) LED39.1(C) LED55.1(C) LED71.1(C) LED87.1(C) LED103.1(C) LED119.1(C) LED135.1(C) LED151.1(C) LED167.1(C) LED183.1(C) LED199.1(C) LED215.1(C) LED231.1(C) LED247.1(C) Q7.3(DRAIN) R7.2 ; port G
H: LED8.1(C) LED24.1(C) LED40.1(C) LED56.1(C) LED72.1(C) LED88.1(C) LED104.1(C) LED120.1(C) LED136.1(C) LED152.1(C) LED168.1(C) LED184.1(C) LED200.1(C) LED216.1(C) LED232.1(C) LED248.1(C) Q8.3(DRAIN) R8.2 ; port H
I: LED9.1(C) LED25.1(C) LED41.1(C) LED57.1(C) LED73.1(C) LED89.1(C) LED105.1(C) LED121.1(C) LED137.1(C) LED153.1(C) LED169.1(C) LED185.1(C) LED201.1(C) LED217.1(C) LED233.1(C) LED249.1(C) Q9.3(DRAIN) R9.2 ; port I
J: LED10.1(C) LED26.1(C) LED42.1(C) LED58.1(C) LED74.1(C) LED90.1(C) LED106.1(C) LED122.1(C) LED138.1(C) LED154.1(C) LED170.1(C) LED186.1(C) LED202.1(C) LED218.1(C) LED234.1(C) LED250.1(C) Q10.3(DRAIN) R10.2 ; port J
K: LED11.1(C) LED27.1(C) LED43.1(C) LED59.1(C) LED75.1(C) LED91.1(C) LED107.1(C) LED123.1(C) LED139.1(C) LED155.1(C) LED171.1(C) LED187.1(C) LED203.1(C) LED219.1(C) LED235.1(C) LED251.1(C) Q11.3(DRAIN) R11.2 ; port K
L: LED12.1(C) LED28.1(C) LED44.1(C) LED60.1(C) LED76.1(C) LED92.1(C) LED108.1(C) LED124.1(C) LED140.1(C) LED156.1(C) LED172.1(C) LED188.1(C) LED204.1(C) LED220.1(C) LED236.1(C) LED252.1(C) Q12.3(DRAIN) R12.2 ; port L
M: LED13.1(C) LED29.1(C) LED45.1(C) LED61.1(C) LED77.1(C) LED93.1(C) LED109.1(C) LED125.1(C) LED141.1(C) LED157.1(C) LED173.1(C) LED189.1(C) LED205.1(C) LED221.1(C) LED237.1(C) LED253.1(C) Q13.3(DRAIN) R13.2 ; port M
N: LED14.1(C) LED30.1(C) LED46.1(C) LED62.1(C) LED78.1(C) LED94.1(C) LED110.1(C) LED126.1(C) LED142.1(C) LED158.1(C) LED174.1(C) LED190.1(C) LED206.1(C) LED222.1(C) LED238.1(C) LED254.1(C) Q14.3(DRAIN) R14.2 ; port N
O: LED15.1(C) LED31.1(C) LED47.1(C) LED63.1(C) LED79.1(C) LED95.1(C) LED111.1(C) LED127.1(C) LED143.1(C) LED159.1(C) LED175.1(C) LED191.1(C) LED207.1(C) LED223.1(C) LED239.1(C) LED255.1(C) Q15.3(DRAIN) R15.2 ; port O
P: LED16.1(C) LED32.1(C) LED48.1(C) LED64.1(C) LED80.1(C) LED96.1(C) LED112.1(C) LED128.1(C) LED144.1(C) LED160.1(C) LED176.1(C) LED192.1(C) LED208.1(C) LED224.1(C) LED240.1(C) LED256.1(C) Q16.3(DRAIN) R16.2 ; port P
NetC3_2: C3.2 R21.1 U1.11(CCLK) U1.13(RCLK) U2.11(φI) X1.1
NetC4_2: C4.2 R22.1 X1.2
NetDIP1_9: DIP1.9 R33.1 U6.3(A7)
NetDIP1_10: DIP1.10 R32.1 U6.25(A8)
NetDIP1_11: DIP1.11 R31.1 U6.24(A9)
NetDIP1_12: DIP1.12 R30.1 U6.21(A10)
NetDIP1_13: DIP1.13 R29.1 U6.23(A11)
NetDIP1_14: DIP1.14 R28.1 U6.2(A12)
NetDIP1_15: DIP1.15 R27.1 U6.26(A13)
NetDIP1_16: DIP1.16 R26.1 U6.1(A14)
NetJ1_1: J1.1 U2.7(Q4)
NetJ1_2: J1.2 U2.5(Q5)
NetJ1_3: J1.3 U2.4(Q6)
NetJ1_4: J1.4 U2.6(Q7)
NetJ1_5: J1.5 U2.14(Q8)
NetJ1_6: J1.6 U2.13(Q9)
NetJ1_7: J1.7 U2.15(Q10)
NetJ1_8: J1.8 U2.1(Q12)
NetJ1_9: J1.9 U2.2(Q13)
NetJ1_10: J1.10 U2.3(Q14)
NetJ2_1: J2.1 U1.7(QH)
NetJ2_2: J2.2 U1.6(QG)
NetJ2_3: J2.3 U1.5(QF)
NetQ1_2: Q1.2(GATE) U7.1(Y0)
NetQ2_2: Q2.2(GATE) U7.2(Y1)
NetQ3_2: Q3.2(GATE) U7.3(Y2)
NetQ4_2: Q4.2(GATE) U7.4(Y3)
NetQ5_2: Q5.2(GATE) U7.5(Y4)
NetQ6_2: Q6.2(GATE) U7.6(Y5)
NetQ7_2: Q7.2(GATE) U7.7(Y6)
NetQ8_2: Q8.2(GATE) U7.8(Y7)
NetQ9_2: Q9.2(GATE) U7.9(Y8)
NetQ10_2: Q10.2(GATE) U7.10(Y9)
NetQ11_2: Q11.2(GATE) U7.11(Y10)
NetQ12_2: Q12.2(GATE) U7.13(Y11)
NetQ13_2: Q13.2(GATE) U7.14(Y12)
NetQ14_2: Q14.2(GATE) U7.15(Y13)
NetQ15_2: Q15.2(GATE) U7.16(Y14)
NetQ16_2: Q16.2(GATE) U7.17(Y15)
NetQ17_2: Q17.2(GATE) U1.15(QA) U5.1(OE1#) U6.10(A0)
NetQ17_3: Q17.3(DRAIN) R18.1 U3.1(OE1#)
NetR17_2: R17.2 U2.12(MR)
NetR19_2: R19.2 U1.12(CCKEN#) U1.14(OE#)
NetR20_1: R20.1 U1.10(CCLR#)
NetR21_2: R21.2 R22.2 U2.10(φO#)
NetR23_1: R23.1 U6.27(WE#)
NetR24_1: R24.1 U6.22(OE#)
NetR25_1: R25.1 U6.20(CE#)
NetR34_1: R34.1 SW1.8 U6.4(A6)
NetR35_1: R35.1 SW1.7 U6.5(A5)
NetR36_1: R36.1 SW1.6
NetR37_1: R37.1 SW1.5
NetU1_1: U1.1(QB) U6.9(A1) U7.23(A0)
NetU1_2: U1.2(QC) U6.8(A2) U7.22(A1)
NetU1_3: U1.3(QD) U6.7(A3) U7.21(A2)
NetU1_4: U1.4(QE) U6.6(A4) U7.20(A3)
NetU3_2: U3.2(A0) U5.2(A0) U6.11(I/O0)
NetU3_3: U3.3(A1) U5.3(A1) U6.12(I/O1)
NetU3_4: U3.4(A2) U5.4(A2) U6.13(I/O2)
NetU3_6: U3.6(A4) U5.6(A4) U6.16(I/O4)
NetU3_7: U3.7(A5) U5.7(A5) U6.17(I/O5)
NetU3_8: U3.8(A6) U5.8(A6) U6.18(I/O6)
NetU3_9: U3.9(A7) U5.9(A7) U6.19(I/O7)

Not connected (* = marked no-connect by the designer): LED1 3; LED2 3; LED3 3; LED4 3; LED5 3; LED6 3; LED7 3; LED8 3; LED9 3; LED10 3; LED11 3; LED12 3; LED13 3; LED14 3; LED15 3; LED16 3; LED17 3; LED18 3; LED19 3; LED20 3; LED21 3; LED22 3; LED23 3; LED24 3; LED25 3; LED26 3; LED27 3; LED28 3; LED29 3; LED30 3; LED31 3; LED32 3; LED33 3; LED34 3; LED35 3; LED36 3; LED37 3; LED38 3; LED39 3; LED40 3; LED41 3; LED42 3; LED43 3; LED44 3; LED45 3; LED46 3; LED47 3; LED48 3; LED49 3; LED50 3; LED51 3; LED52 3; LED53 3; LED54 3; LED55 3; LED56 3; LED57 3; LED58 3; LED59 3; LED60 3; LED61 3; LED62 3; LED63 3; LED64 3; LED65 3; LED66 3; LED67 3; LED68 3; LED69 3; LED70 3; LED71 3; LED72 3; LED73 3; LED74 3; LED75 3; LED76 3; LED77 3; LED78 3; LED79 3; LED80 3; LED81 3; LED82 3; LED83 3; LED84 3; LED85 3; LED86 3; LED87 3; LED88 3; LED89 3; LED90 3; LED91 3; LED92 3; LED93 3; LED94 3; LED95 3; LED96 3; LED97 3; LED98 3; LED99 3; LED100 3; LED101 3; LED102 3; LED103 3; LED104 3; LED105 3; LED106 3; LED107 3; LED108 3; LED109 3; LED110 3; LED111 3; LED112 3; LED113 3; LED114 3; LED115 3; LED116 3; LED117 3; LED118 3; LED119 3; LED120 3; LED121 3; LED122 3; LED123 3; LED124 3; LED125 3; LED126 3; LED127 3; LED128 3; LED129 3; LED130 3; LED131 3; LED132 3; LED133 3; LED134 3; LED135 3; LED136 3; LED137 3; LED138 3; LED139 3; LED140 3; LED141 3; LED142 3; LED143 3; LED144 3; LED145 3; LED146 3; LED147 3; LED148 3; LED149 3; LED150 3; LED151 3; LED152 3; LED153 3; LED154 3; LED155 3; LED156 3; LED157 3; LED158 3; LED159 3; LED160 3; LED161 3; LED162 3; LED163 3; LED164 3; LED165 3; LED166 3; LED167 3; LED168 3; LED169 3; LED170 3; LED171 3; LED172 3; LED173 3; LED174 3; LED175 3; LED176 3; LED177 3; LED178 3; LED179 3; LED180 3; LED181 3; LED182 3; LED183 3; LED184 3; LED185 3; LED186 3; LED187 3; LED188 3; LED189 3; LED190 3; LED191 3; LED192 3; LED193 3; LED194 3; LED195 3; LED196 3; LED197 3; LED198 3; LED199 3; LED200 3; LED201 3; LED202 3; LED203 3; LED204 3; LED205 3; LED206 3; LED207 3; LED208 3; LED209 3; LED210 3; LED211 3; LED212 3; LED213 3; LED214 3; LED215 3; LED216 3; LED217 3; LED218 3; LED219 3; LED220 3; LED221 3; LED222 3; LED223 3; LED224 3; LED225 3; LED226 3; LED227 3; LED228 3; LED229 3; LED230 3; LED231 3; LED232 3; LED233 3; LED234 3; LED235 3; LED236 3; LED237 3; LED238 3; LED239 3; LED240 3; LED241 3; LED242 3; LED243 3; LED244 3; LED245 3; LED246 3; LED247 3; LED248 3; LED249 3; LED250 3; LED251 3; LED252 3; LED253 3; LED254 3; LED255 3; LED256 3; U1 9(RCO#)*; U2 9(φO)*; U4 2(GND)

## Library data of the parts
C1 = 10uF: Manufacturer: TORCH(火炬); Manufacturer Part: CC1210Y5V16V106ZN; Contributor: lcsc; nameAlias: Value; Supplier: LCSC; Supplier Part: C54916872; JLCPCB Part Class: Extended Part; spicePre: C; spiceSymbolName: CC1210Y5V16V106ZN
C2 = 10nF: Manufacturer: HRE(芯声); Manufacturer Part: CSA0805C0G103J500MT; nameAlias: Value; Contributor: lcsc; Supplier: LCSC; Supplier Part: C49270298; JLCPCB Part Class: Extended Part; spicePre: C; spiceSymbolName: CSA0805C0G103J500MT
C3 C4 = 33pF: Manufacturer: Kyocera AVX; Manufacturer Part: 600F330JT250XT; nameAlias: Value; Contributor: lcsc; Supplier: LCSC; Supplier Part: C3838790; JLCPCB Part Class: Extended Part; spicePre: C; spiceSymbolName: 600F330JT250XT
C6 = 33uF: Manufacturer: Jianghai(南通江海); Manufacturer Part: ECR1HPT330MLL063011; nameAlias: Value; Contributor: LCSC; Supplier: LCSC; Supplier Part: C216549; JLCPCB Part Class: Extended Part; spicePre: C; spiceSymbolName: ECR1HPT330MLL063011
C7 = 470nF: Manufacturer: Chengx(承兴); Manufacturer Part: kF474M050C05RR0VH2FP0; nameAlias: Value; Supplier: LCSC; Supplier Part: C45095; JLCPCB Part Class: Extended Part; spicePre: C; spiceSymbolName: 0.47uF 50V 4*5
DIP1 = DIP switchEI-08: Manufacturer: Diptronics(圜达); Manufacturer Part: EI-08-V; Supplier: LCSC; Supplier Part: C90019; JLCPCB Part Class: Extended Part; spicePre: D; spiceSymbolName: DIP switchEI-08
J1 = HDR-M-2.54_1x10: Manufacturer: hanxia(韩下); Manufacturer Part: HX PZ-2005WV-1x10P; Contributor: LCEDA_Lib; Supplier Part: C42391526; Supplier: LCSC; spicePre: J; spiceSymbolName: HDR-M-2.54_1x10
J2 = HDR-M-2.54_1x3: Manufacturer: HDGC(华德共创); Manufacturer Part: 5557WRF-1X3P(HDGC4201WR-F-1X3P); Contributor: LCEDA_Lib; Supplier Part: C54557117; Supplier: LCSC; spicePre: J; spiceSymbolName: HDR-M-2.54_1x3
J3 = HDR-M-2.54_1x2: Contributor: LCEDA_Lib; Supplier Part: C124375; Supplier: LCSC; spicePre: J; spiceSymbolName: HDR-M-2.54_1x2
LED1-LED256 = HL-A-5730D34WY-S1-08-CZ(LY): Manufacturer: HONGLITRONIC(鸿利光电); Contributor: lcsc; Package Display: No; Supplier: LCSC; Supplier Part: C49435712; Manufacturer Part: HL-A-5730D34WY-S1-08-CZ(LY); JLCPCB Part Class: Extended Part; spicePre: L; spiceSymbolName: HL-A-5730D34WY-S1-08-CZ(LY)
Q1-Q17 = 2N7000-TA: Manufacturer: CJ(江苏长电/长晶); Contributor: LCSC; Supplier: LCSC; Supplier Part: C2910414; Manufacturer Part: 2N7000-TA; JLCPCB Part Class: Extended Part; spicePre: Q; spiceSymbolName: 2N7000-TA
R1-R20 R23-R37 = 10k: Manufacturer Part: MFR-12FTF52-10K; Manufacturer: YAGEO(国巨); nameAlias: Value(Ω); Contributor: LCEDA_Lib; Supplier Part: C3356784; Supplier: LCSC; spicePre: R; spiceSymbolName: R_0603_EU
R21 = 1M: Manufacturer Part: FRC2512F1004TS; Manufacturer: FOJAN(富捷); nameAlias: Value(Ω); Contributor: LCEDA_Lib; Supplier Part: C3000673; Supplier: LCSC; spicePre: R; spiceSymbolName: R_0603_EU
R22 = 2.2k: Manufacturer Part: MF0204FTE52-2K2; Manufacturer: YAGEO(国巨); nameAlias: Value(Ω); Contributor: LCEDA_Lib; Supplier Part: C20611863; Supplier: LCSC; spicePre: R; spiceSymbolName: R_0603_EU
SW1 = DIP switchEI-04: Manufacturer: 圜达; Manufacturer Part: 拨码开关EI-04; Supplier: LCSC; Supplier Part: C99987; JLCPCB Part Class: Extended Part; spicePre: S; spiceSymbolName: DIP switchEI-04
U1 = SN74HC590ADR: Manufacturer: TI(德州仪器); Contributor: LCSC; Supplier: LCSC; Supplier Part: C2652997; Manufacturer Part: SN74HC590ADR; JLCPCB Part Class: Extended Part; spicePre: U; spiceSymbolName: SN74HC590ADR
U2 = CD74HC4060M96: Manufacturer: TI(德州仪器); Supplier: LCSC; Manufacturer Part: CD74HC4060M96; Supplier Part: C134017; JLCPCB Part Class: Extended Part; spicePre: U; spiceSymbolName: CD74HC4060M96
U3 U5 = 74LVC541AD-Q100J: Manufacturer: Nexperia(安世); Contributor: LCSC; Supplier: LCSC; Supplier Part: C548810; Manufacturer Part: 74LVC541AD-Q100J; JLCPCB Part Class: Extended Part; spicePre: U; spiceSymbolName: 74LVC541AD-Q100J
U4 = LM3940IMPX-3.3/NOPB: Manufacturer: TI(德州仪器); Contributor: LCSC; Supplier: LCSC; Supplier Part: C544820; Manufacturer Part: LM3940IMPX-3.3/NOPB; JLCPCB Part Class: Extended Part; spicePre: U; spiceSymbolName: LM3940IMPX-3.3/NOPB
U6 = AT28C256-15PU: Manufacturer: MICROCHIP(美国微芯); Contributor: LCSC; Supplier: LCSC; Supplier Part: C1348752; Manufacturer Part: AT28C256-15PU; JLCPCB Part Class: Extended Part; spicePre: U; spiceSymbolName: AT28C256-15PU
U7 = HT74HC154ARWZ: Manufacturer: HTCSEMI(海天芯); Contributor: lcsc; Supplier: LCSC; Supplier Part: C3019555; Manufacturer Part: HT74HC154ARWZ; JLCPCB Part Class: Extended Part; spicePre: U; spiceSymbolName: HT74HC154ARWZ
X1 = 32.768kHz: Manufacturer: SOSET(索斯特); Manufacturer Part: SCFYS32X76800YERN; nameAlias: Value; Contributor: lcsc; Supplier: LCSC; Supplier Part: C50396607; JLCPCB Part Class: Extended Part; spicePre: X; spiceSymbolName: SCFYS32X76800YERN